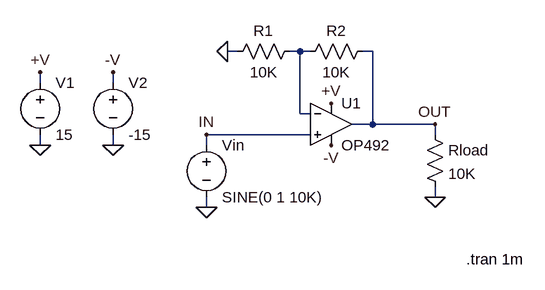
[diagram p0: schematic OP492.asc]
OP492.asc, the LTspice schematic file:
Version 4
SHEET 1 1240 700
WIRE 432 -1216 416 -1216
WIRE 528 -1216 512 -1216
WIRE 544 -1216 528 -1216
WIRE 640 -1216 624 -1216
WIRE 128 -1168 128 -1184
WIRE 240 -1168 240 -1184
WIRE 528 -1120 528 -1216
WIRE 544 -1120 528 -1120
WIRE 640 -1104 640 -1216
WIRE 640 -1104 608 -1104
WIRE 736 -1104 640 -1104
WIRE 544 -1088 384 -1088
WIRE 736 -1088 736 -1104
WIRE 128 -1072 128 -1088
WIRE 240 -1072 240 -1088
WIRE 384 -1072 384 -1088
WIRE 736 -992 736 -1008
WIRE 384 -976 384 -992
FLAG 128 -1184 +V
FLAG 128 -1072 0
FLAG 384 -976 0
FLAG 736 -1104 OUT
FLAG 384 -1088 IN
FLAG 576 -1136 +V
FLAG 240 -1184 -V
FLAG 576 -1072 -V
FLAG 416 -1216 0
FLAG 736 -992 0
FLAG 240 -1072 0
SYMBOL voltage 128 -1184 R0
WINDOW 123 0 0 Left 2
WINDOW 39 0 0 Left 2
SYMATTR InstName V1
SYMATTR Value 15
SYMBOL voltage 384 -1088 R0
WINDOW 123 24 146 Left 2
WINDOW 39 24 125 Left 2
SYMATTR InstName Vin
SYMATTR Value SINE(0 1 10K)
SYMBOL res 528 -1232 R90
WINDOW 0 0 56 VBottom 2
WINDOW 3 32 56 VTop 2
SYMATTR InstName R1
SYMATTR Value 10K
SYMBOL res 640 -1232 R90
WINDOW 0 0 56 VBottom 2
WINDOW 3 32 56 VTop 2
SYMATTR InstName R2
SYMATTR Value 10K
SYMBOL Opamps\\OP492 576 -1168 R0
SYMATTR InstName U1
SYMBOL voltage 240 -1184 R0
WINDOW 123 24 146 Left 2
WINDOW 39 24 125 Left 2
SYMATTR InstName V2
SYMATTR Value -15
SYMBOL res 720 -1104 R0
SYMATTR InstName Rload
SYMATTR Value 10K
TEXT 784 -896 Left 2 !.tran 1m

The netlist it stands for:
* OP492.asc
V1 +V 0 15
Vin IN 0 SINE(0 1 10K)
R1 N001 0 10K
R2 OUT N001 10K
XU1 IN N001 +V -V OUT OP492  ; pins In+ In- V+ V- OUT
V2 -V 0 -15
Rload OUT 0 10K
.tran 1m
.backanno
.end